# Altium project PCB_Project.PrjPcb
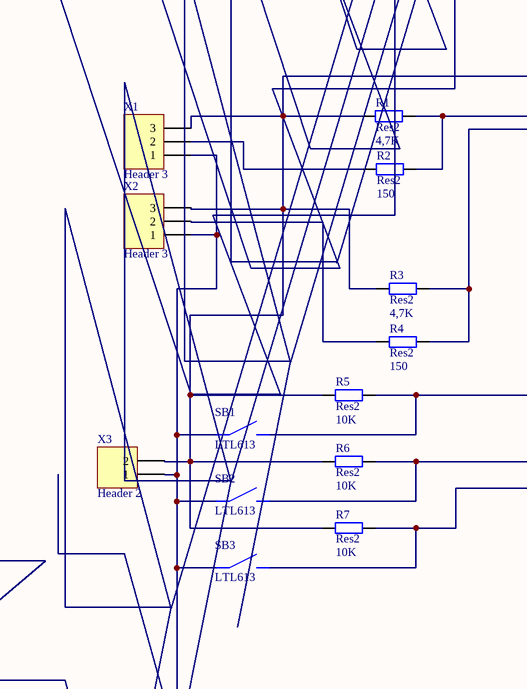
[diagram p0: Sheet1.SchDoc, bottom left]
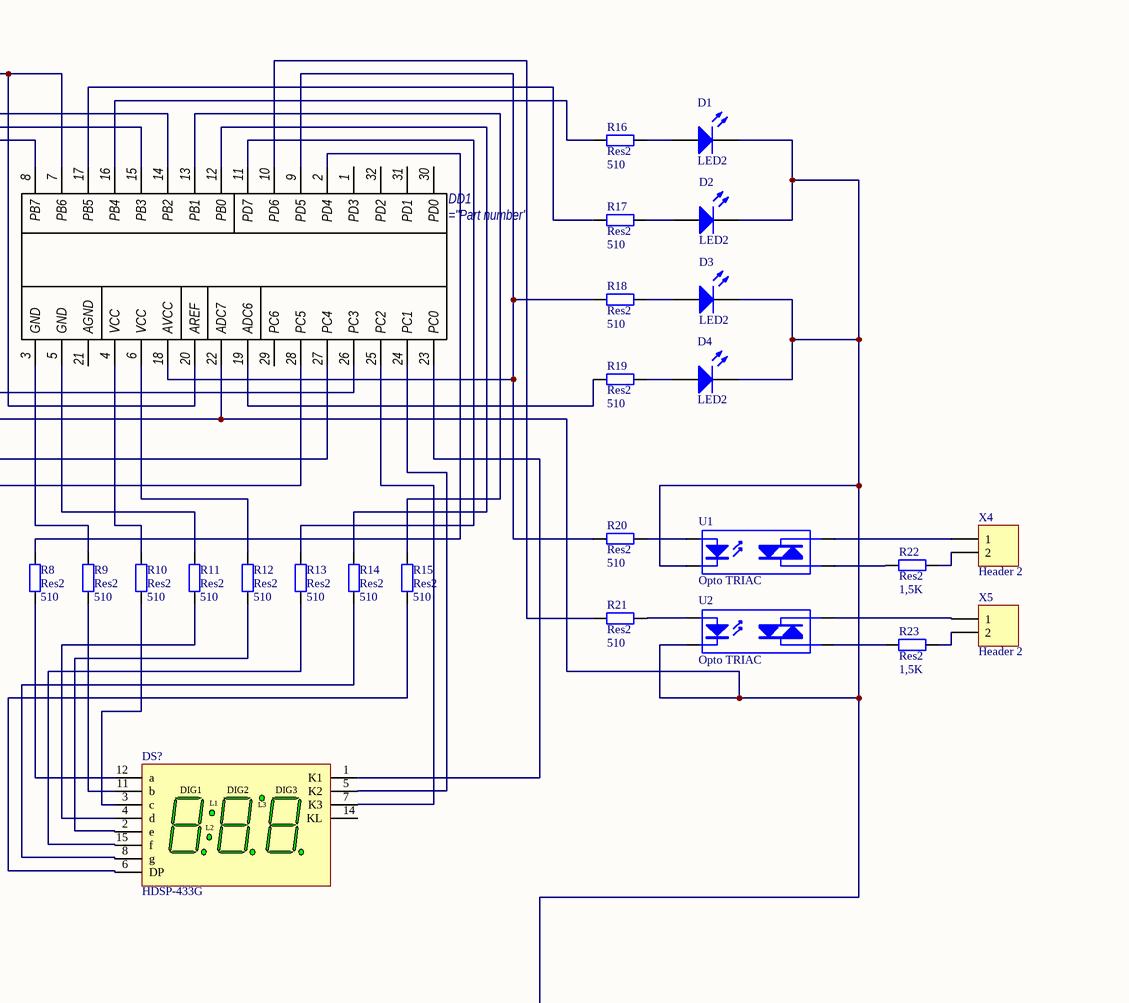
[diagram p1: Sheet1.SchDoc, bottom right]
1 sheet, 39 parts. Net scope: global (net labels, ports and power ports of the same name join across sheets).
Board file: PCB1.PcbDoc

## Sheet Sheet1.SchDoc
size A4

### Parts
D1  LED2  [3.2X1.6X1.1]
D2  LED2  [3.2X1.6X1.1]
D3  LED2  [3.2X1.6X1.1]
D4  LED2  [3.2X1.6X1.1]
DD1  (no value)
DS?  HDSP-433G  [HDSP-4]
R1  Res2  value 4,7K  [AXIAL-0.4]
R2  Res2  value 150  [AXIAL-0.4]
R3  Res2  value 4,7K  [AXIAL-0.4]
R4  Res2  value 150  [AXIAL-0.4]
R5  Res2  value 10K  [AXIAL-0.4]
R6  Res2  value 10K  [AXIAL-0.4]
R7  Res2  value 10K  [AXIAL-0.4]
R8  Res2  value 510  [AXIAL-0.4]
R9  Res2  value 510  [AXIAL-0.4]
R10  Res2  value 510  [AXIAL-0.4]
R11  Res2  value 510  [AXIAL-0.4]
R12  Res2  value 510  [AXIAL-0.4]
R13  Res2  value 510  [AXIAL-0.4]
R14  Res2  value 510  [AXIAL-0.4]
R15  Res2  value 510  [AXIAL-0.4]
R16  Res2  value 510  [AXIAL-0.4]
R17  Res2  value 510  [AXIAL-0.4]
R18  Res2  value 510  [AXIAL-0.4]
R19  Res2  value 510  [AXIAL-0.4]
R20  Res2  value 510  [AXIAL-0.4]
R21  Res2  value 510  [AXIAL-0.4]
R22  Res2  value 1,5K  [AXIAL-0.4]
R23  Res2  value 1,5K  [AXIAL-0.4]
SB1  LTL613  [LTL613]
SB2  LTL613  [LTL613]
SB3  LTL613  [LTL613]
U1  Opto TRIAC  [NPSIP4A]
U2  Opto TRIAC  [NPSIP4A]
X1  Header 3  [HDR1X3]
X2  Header 3  [HDR1X3]
X3  Header 2  [HDR1X2]
X4  Header 2  [HDR1X2]
X5  Header 2  [HDR1X2]

### Nets
NetD1_1: D1.1(A) R16.2
NetD1_2: D1.2(K) D2.2(K) D3.2(K) D4.2(K) DD1.8(PB7) DD1.22(ADC7) SB1.0 SB2.0 SB3.0 U1.2(K) U2.2(K) X1.1 X2.1 X3.1
NetD2_1: D2.1(A) R17.2
NetD3_1: D3.1(A) R18.2
NetD4_1: D4.1(A) R19.2
NetDD1_2: DD1.2(PD4) R8.2
NetDD1_3: DD1.3(GND) R9.2
NetDD1_4: DD1.4(VCC) R10.2
NetDD1_5: DD1.5(GND) R11.2
NetDD1_6: DD1.6(VCC) R12.2
NetDD1_7: DD1.7(PB6) DD1.20(AREF) R1.1 R3.1 R4.1 R5.1 R6.1 R7.1 X1.3 X2.2 X2.3 X3.2
NetDD1_9: DD1.9(PD5) DD1.18(AVCC) R18.1 R20.1
NetDD1_10: DD1.10(PD6) R21.1
NetDD1_11: DD1.11(PD7) R13.2
NetDD1_12: DD1.12(PB0) R14.2
NetDD1_13: DD1.13(PB1) R15.2
NetDD1_14: DD1.14(PB2) R1.2 R2.2
NetDD1_15: DD1.15(PB3) R3.2 R4.2
NetDD1_16: DD1.16(PB4) R16.1
NetDD1_17: DD1.17(PB5) R17.1
NetDD1_19: DD1.19(ADC6) R19.1
NetDD1_23: DD1.23(PC0) DS?.1(K1)
NetDD1_24: DD1.24(PC1) DS?.5(K2)
NetDD1_25: DD1.25(PC2) DS?.7(K3)
NetDD1_26: DD1.26(PC3) R5.2 SB1.1
NetDD1_27: DD1.27(PC4) R6.2 SB2.1
NetDD1_28: DD1.28(PC5) R7.2 SB3.1
NetDS?_2: DS?.2(e) R12.1
NetDS?_3: DS?.3(c) R10.1
NetDS?_4: DS?.4(d) R11.1
NetDS?_6: DS?.6(DP) R15.1
NetDS?_8: DS?.8(g) R14.1
NetDS?_11: DS?.11(b) R9.1
NetDS?_12: DS?.12(a) R8.1
NetDS?_15: DS?.15(f) R13.1
NetR2_1: R2.1 X1.2
NetR20_2: R20.2 U1.1(A)
NetR21_2: R21.2 U2.1(A)
NetR22_1: R22.1 U1.4(A/K)
NetR22_2: R22.2 X4.2
NetR23_1: R23.1 U2.4(A/K)
NetR23_2: R23.2 X5.2
NetU1_3: U1.3(A/K) X4.1
NetU2_3: U2.3(A/K) X5.1

Not connected (* = marked no-connect by the designer): DD1 1(PD3) 21(AGND) 29(PC6) 30(PD0) 31(PD1) 32(PD2); DS? 14(KL)

### Notes on the sheet
- (in symbol HDSP-433G) DIG1; DIG2; DIG3; L1; L3; L2

### Library data of the parts
D1-D4 = LED2: Typical RED, GREEN, YELLOW, AMBER GaAs LED; Published: 8-Jun-2000; LatestRevisionDate: 17-Jul-2002; LatestRevisionNote: Re-released for DXP Platform.; PackageVersion: Feb-2002; PackageReference: 3.2X1.6X1.1; Publisher: Altium Limited; PackageDescription: SM LED; 2 Flat Leads
DD1 = Atmega8
DS? = HDSP-433G: 10 mm Gray Surface 7-Segment Display: 3-Digit with 2-Colons, CC, Slim Font, Untinted-Diffused; LuminousIntensity: 3200 ucd (Minimum).; LED_Colour: Green; Note: No pins are present in positions 9, 10 and 13.; Published: 26-May-2004; LatestRevisionDate: 11-Oct-2004; LatestRevisionNote: Display outline superimposed on PCB Footprint.; DatasheetDocument: 20-Nov-2001; PackageDocument: 20-Nov-2001; PackageReference: HDSP-4; Publisher: Altium Limited; ComponentLink1Description: Manufacturer Link; ComponentLink1URL: http://www.agilent.com/; ComponentLink2Description: Datasheet; ComponentLink2URL: http://cp.literature.agilent.com/litweb/pdf/5988-4824EN.pdf
R1-R23 = Res2: Resistor; Published: 8-Jun-2000; LatestRevisionDate: 17-Jul-2002; LatestRevisionNote: Re-released for DXP Platform.; PackageReference: AXIAL-0.4; Publisher: Altium Limited; PackageDescription: Axial Device, Thru-Hole; 2 Leads; 0.4 in Pin Spacing
SB1-SB3 = Button_tact: Tact button switch
U1 U2 = Opto TRIAC: Opto-Triac; Published: 24-Mar-1999; LatestRevisionDate: 17-Jul-2002; LatestRevisionNote: Re-released for DXP Platform.; PackageReference: NPSIP4A; Publisher: Altium Limited; PackageDescription: SIP; 4 Leads; Body 10 x 11.5 x 7.5 mm (typ); Pitch 2.54 mm
X1 X2 = Header 3: Header, 3-Pin; LatestRevisionDate: 17-Jul-2002; LatestRevisionNote: Re-released for DXP Platform.; Publisher: Altium Limited
X3-X5 = Header 2: Header, 2-Pin; LatestRevisionDate: 17-Jul-2002; LatestRevisionNote: Re-released for DXP Platform.; Publisher: Altium Limited